# EAGLE design main3 (EAGLE 9.1.0)
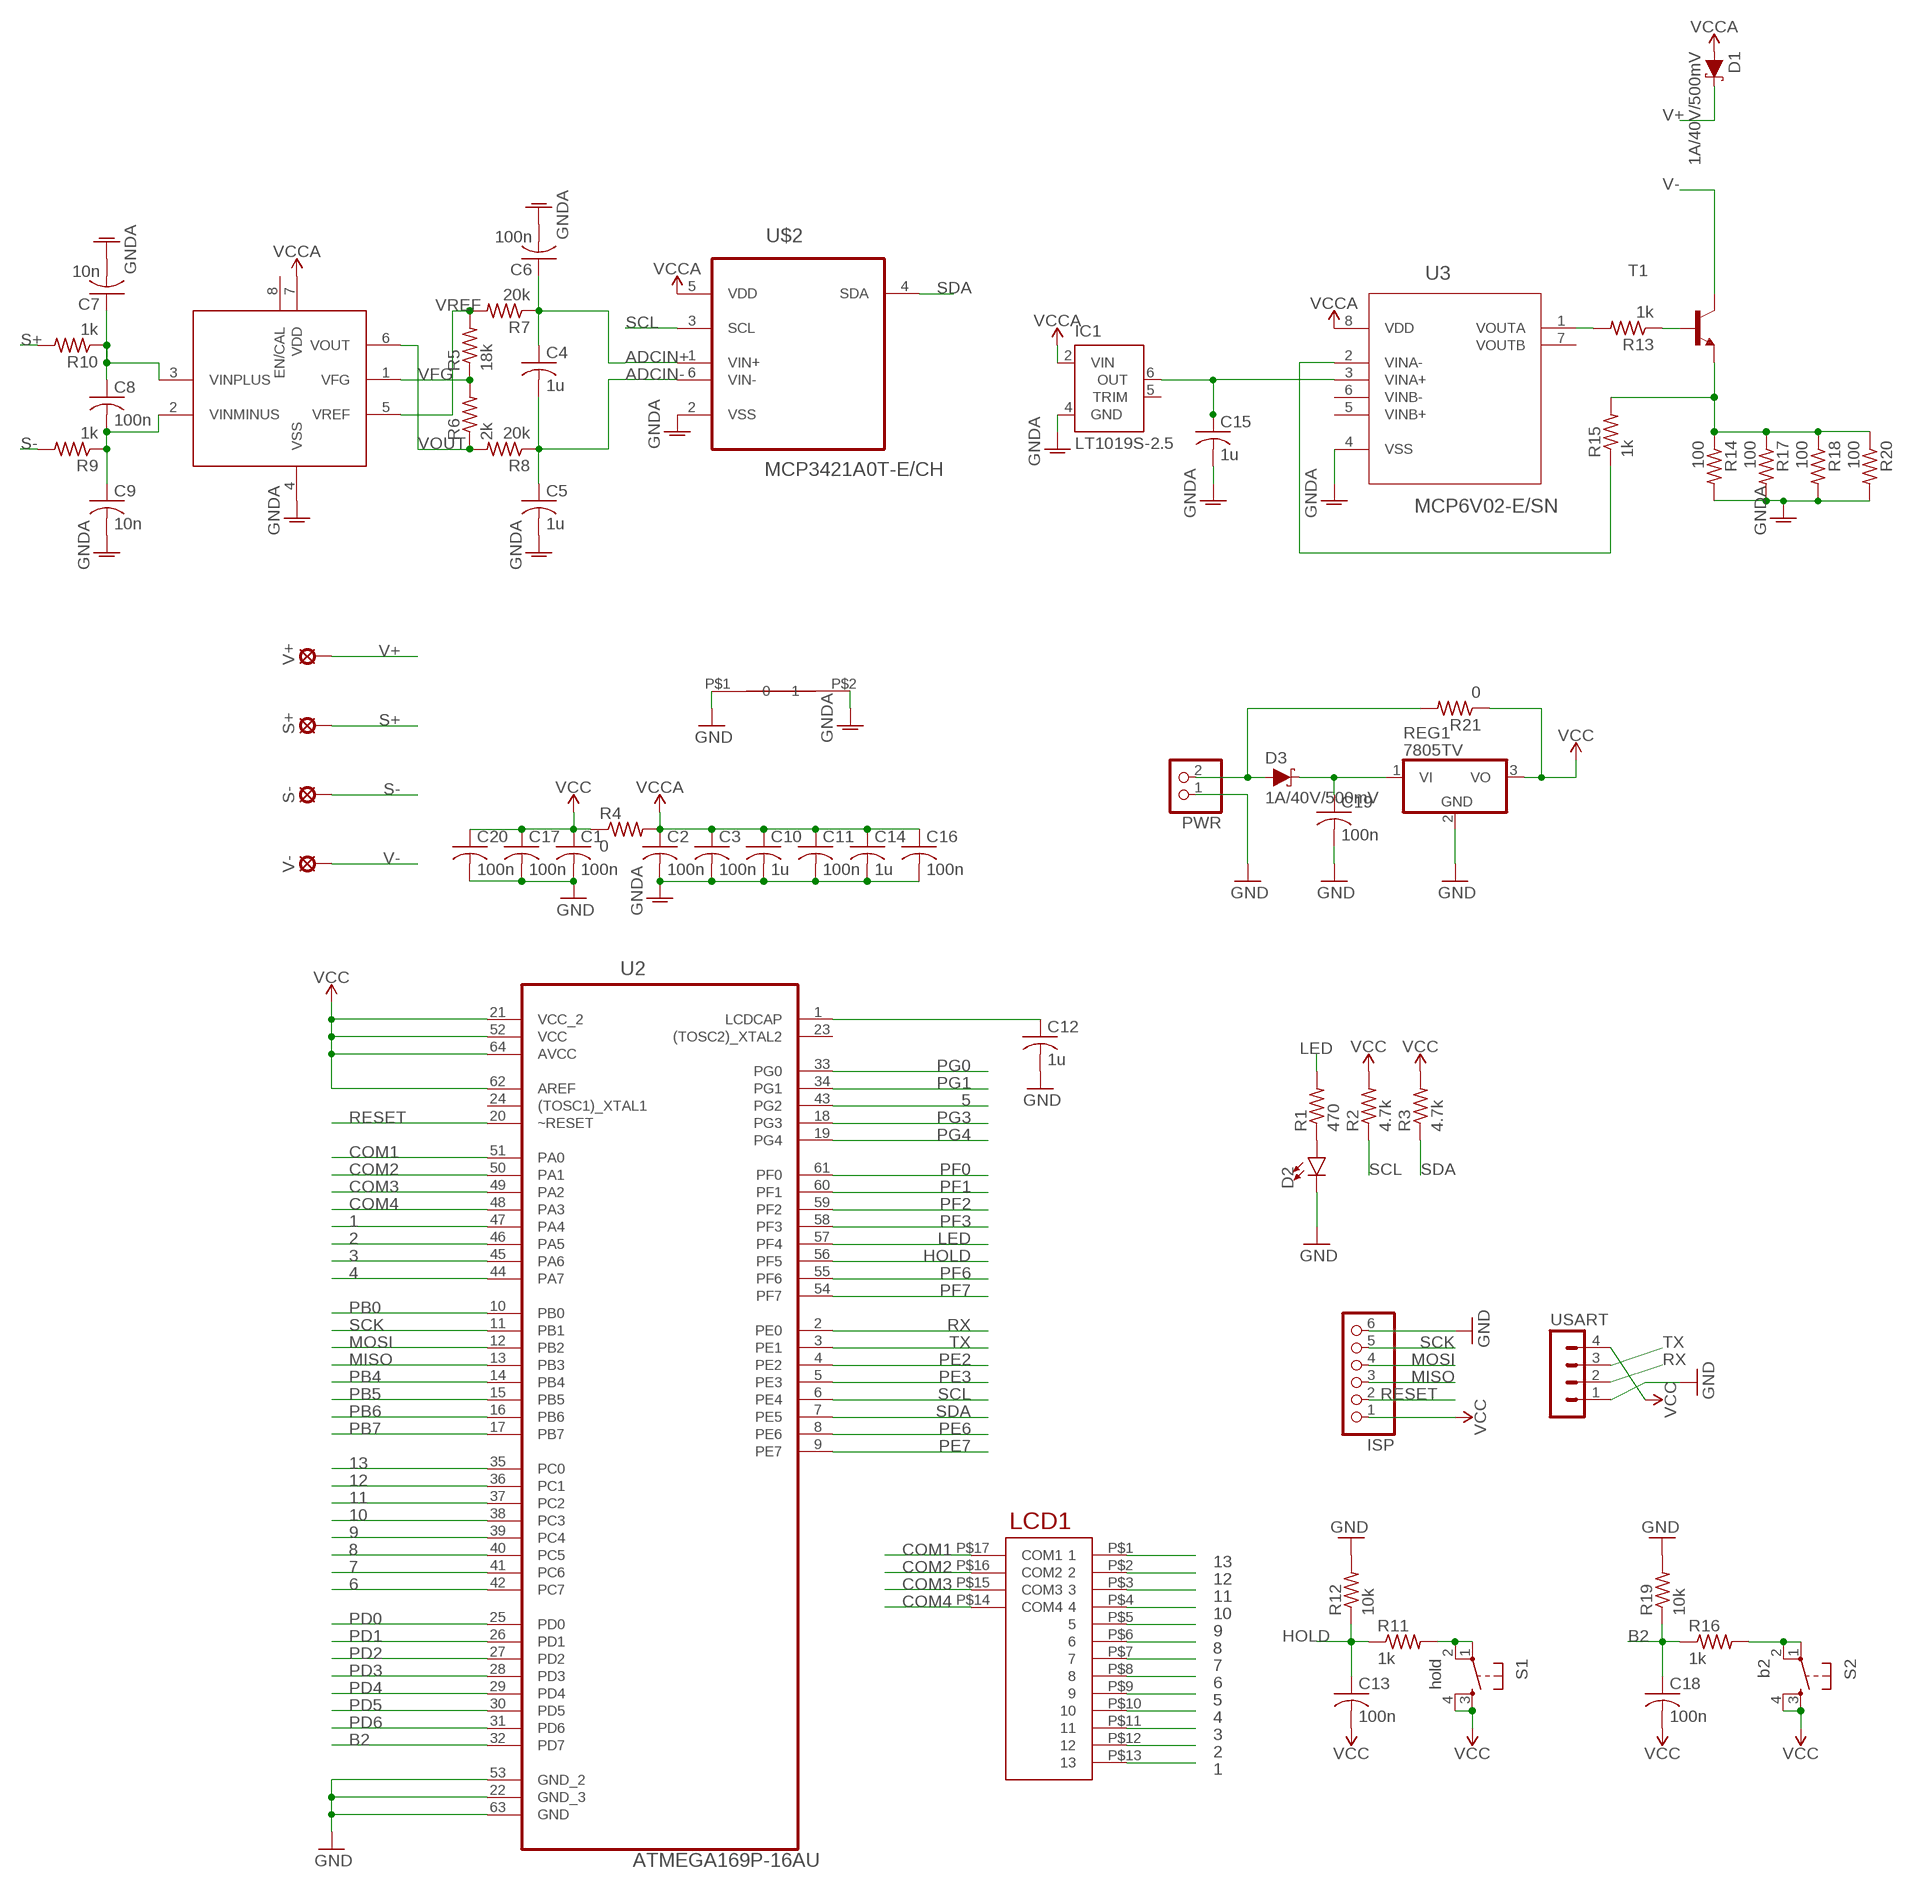
[diagram p0: schematic, sheet 1]

## Parts
C1  100n  C-USC0603  [C0603]
C2  100n  C-USC0603  [C0603]
C3  100n  C-USC0603  [C0603]
C4  1u  C-USC0603  [C0603]
C5  1u  C-USC0603  [C0603]
C6  100n  C-USC0603  [C0603]
C7  10n  C-USC0603  [C0603]
C8  100n  C-USC0603  [C0603]
C9  10n  C-USC0603  [C0603]
C10  1u  C-USC0603  [C0603]
C11  100n  C-USC0603  [C0603]
C12  1u  C-USC0603  [C0603]
C13  100n  C-USC0603  [C0603]
C14  1u  C-USC0603  [C0603]
C15  1u  C-USC0603  [C0603]
C16  100n  C-USC0603  [C0603]
C17  100n  C-USC0603  [C0603]
C18  100n  C-USC0603  [C0603]
C19  100n  C-USC0603  [C0603]
C20  100n  C-USC0603  [C0603]
D1  1A/40V/500mV  DIODE-SCHOTTKY-SS14  [SMA-DIODE]
D2  LED5MM  [LED_5MM]
D3  1A/40V/500mV  DIODE-SCHOTTKY-SS14  [SMA-DIODE]
IC1  LT1019S-2.5  [SOIC8]
ISP  PINHD-1X6  [1X06]
LCD1  GDC0570_LCD  [GDC0570_LCD]
PWR  PINHD-1X2  [1X02]
R1  470  R-US_R0603  [R0603]
R2  4.7k  R-US_R0603  [R0603]
R3  4.7k  R-US_R0603  [R0603]
R4  0  R-US_0309/12  [0309/12]
R5  18k  R-US_R0603  [R0603]
R6  2k  R-US_R0603  [R0603]
R7  20k  R-US_R0603  [R0603]
R8  20k  R-US_R0603  [R0603]
R9  1k  R-US_R0603  [R0603]
R10  1k  R-US_R0603  [R0603]
R11  1k  R-US_R0603  [R0603]
R12  10k  R-US_R0603  [R0603]
R13  1k  R-US_R0603  [R0603]
R14  100  R-US_R0603  [R0603]
R15  1k  R-US_R0603  [R0603]
R16  1k  R-US_R0603  [R0603]
R17  100  R-US_R0603  [R0603]
R18  100  R-US_R0603  [R0603]
R19  10k  R-US_R0603  [R0603]
R20  100  R-US_R0603  [R0603]
R21  0  R-US_R0603  [R0603]
REG1  7805TV  [TO220V]
S1  hold  TAC_SWITCHPTH  [TACTILE-PTH]
S2  b2  TAC_SWITCHPTH  [TACTILE-PTH]
S+  MCS08  [MCS08]
S-  MCS08  [MCS08]
T1  MMBT3904LT1-NPN-SOT23-BEC  [SOT23-BEC]
U2  ATMEGA169P-16AU  [QFP80P1600X1600X120-64N]
U3  MCP6V02-E/SN  [SOIC127P600X175-8N]
U$2  MCP3421A0T-E/CH  [SOT95P270X145-6N]
U$3  MCP6N11  [SOIC8]
U$10  SHORT32  [SHORT_32]
USART  MA04-1  [MA04-1]
V+  MCS08  [MCS08]
V-  MCS08  [MCS08]

## Nets
1: LCD1.P$13 U2.47(PA4)
2: LCD1.P$12 U2.46(PA5)
3: LCD1.P$11 U2.45(PA6)
4: LCD1.P$10 U2.44(PA7)
5: LCD1.P$9 U2.43(PG2)
6: LCD1.P$8 U2.42(PC7)
7: LCD1.P$7 U2.41(PC6)
8: LCD1.P$6 U2.40(PC5)
9: LCD1.P$5 U2.39(PC4)
10: LCD1.P$4 U2.38(PC3)
11: LCD1.P$3 U2.37(PC2)
12: LCD1.P$2 U2.36(PC1)
13: LCD1.P$1 U2.35(PC0)
ADCIN+: C4.1 C6.1 R7.1 U$2.1(VIN+)
ADCIN-: C4.2 C5.1 R8.1 U$2.6(VIN-)
B2: C18.1 R16.1 R19.1 U2.32(PD7)
COM1: LCD1.P$17(COM1) U2.51(PA0)
COM2: LCD1.P$16(COM2) U2.50(PA1)
COM3: LCD1.P$15(COM3) U2.49(PA2)
COM4: LCD1.P$14(COM4) U2.48(PA3)
GND: C1.2 C12.2 C17.2 C19.2 C20.2 D2.K(C) ISP.6 PWR.1 R12.2 R19.2 REG1.2(GND) U2.22(GND_3) U2.53(GND_2) U2.63(GND) U$10.P$1 USART.1
GNDA: C2.2 C3.2 C5.2 C6.2 C7.2 C9.2 C10.2 C11.2 C14.2 C15.2 C16.2 IC1.4(GND) R14.2 R17.2 R18.2 R20.2 U3.4(VSS) U$2.2(VSS) U$3.4(VSS) U$10.P$2
HOLD: C13.1 R11.1 R12.1 U2.56(PF5)
LCDCAP: C12.1 U2.1(LCDCAP)
LED: R1.2 U2.57(PF4)
MISO: ISP.3 U2.13(PB3)
MOSI: ISP.4 U2.12(PB2)
N2: R16.2 S2.1 S2.2
N$1: D3.A PWR.2 R21.2
N$2: C15.1 IC1.6(OUT) U3.3(VINA+)
N$3: R14.1 R15.2 R17.1 R18.1 R20.1 T1.E
N$4: C8.2 C9.1 R9.1 U$3.2(VINMINUS)
N$5: C7.1 C8.1 R10.1 U$3.3(VINPLUS)
N$6: D2.A R1.1
N$7: R13.2 U3.1(VOUTA)
N$8: R13.1 T1.B
N$9: R15.1 U3.2(VINA-)
N$10: R11.2 S1.1 S1.2
N$11: C19.1 D3.C REG1.1(VI)
PB0: U2.10(PB0)
PB4: U2.14(PB4)
PB5: U2.15(PB5)
PB6: U2.16(PB6)
PB7: U2.17(PB7)
PD0: U2.25(PD0)
PD1: U2.26(PD1)
PD2: U2.27(PD2)
PD3: U2.28(PD3)
PD4: U2.29(PD4)
PD5: U2.30(PD5)
PD6: U2.31(PD6)
PE2: U2.4(PE2)
PE3: U2.5(PE3)
PE6: U2.8(PE6)
PE7: U2.9(PE7)
PF0: U2.61(PF0)
PF1: U2.60(PF1)
PF2: U2.59(PF2)
PF3: U2.58(PF3)
PF6: U2.55(PF6)
PF7: U2.54(PF7)
PG0: U2.33(PG0)
PG1: U2.34(PG1)
PG3: U2.18(PG3)
PG4: U2.19(PG4)
RESET: ISP.2 U2.20(~RESET)
RX: U2.2(PE0) USART.2
S+: R10.2 S+.MP
S-: R9.2 S-.MP
SCK: ISP.5 U2.11(PB1)
SCL: R2.1 U2.6(PE4) U$2.3(SCL)
SDA: R3.1 U2.7(PE5) U$2.4(SDA)
TX: U2.3(PE1) USART.3
V+: D1.C V+.MP
V-: T1.C V-.MP
VCC: C1.1 C13.2 C17.1 C18.2 C20.1 ISP.1 R2.2 R3.2 R4.1 R21.1 REG1.3(VO) S1.3 S1.4 S2.3 S2.4 U2.21(VCC_2) U2.52(VCC) U2.62(AREF) U2.64(AVCC) USART.4
VCCA: C2.1 C3.1 C10.1 C11.1 C14.1 C16.1 D1.A IC1.2(VIN) R4.2 U3.8(VDD) U$2.5(VDD) U$3.7(VDD)
VFG: R5.1 R6.2 U$3.1(VFG)
VOUT: R6.1 R8.2 U$3.6(VOUT)
VREF: R5.2 R7.2 U$3.5(VREF)
Unconnected: IC1.5(TRIM) U2.23((TOSC2)_XTAL2) U2.24((TOSC1)_XTAL1) U3.5(VINB+) U3.6(VINB-) U3.7(VOUTB) U$3.8(EN/CAL)

## Library data of the parts
C1-C20 = rcl:C-US: CAPACITOR, American symbol; SPICEPREFIX: C
D1 D3 = SparkFun-DiscreteSemi:DIODE-SCHOTTKY: Schottky diode A Schottky diode is a semiconductor diode which has a low forward voltage drop and a very fast switching action.; PROD_ID: DIO-08053
D2 = SparkFun-LED:LED: LED (Generic) Standard schematic elements and footprints for 5mm, 3mm, 1206, and 0603 sized LEDs. Generic LEDs with no color specified.
IC1 = linear-technology:LT1019?*: Precision Voltage Reference Source: http://www.linear.com/pc/downloadDocument.do?navId=H0,C1,C1154,C1002,C1243,P1130,D3834; MPN: LT1019CS8-2.5#PBF; OC_FARNELL: 9559426; OC_NEWARK: 57M0929
ISP = pinhead:PINHD-1X6: PIN HEADER
LCD1 = 7_segment_lib:GDC0570_LCD
PWR = pinhead:PINHD-1X2: PIN HEADER
R1-R21 = rcl:R-US_: RESISTOR, American symbol; SPICEPREFIX: R
REG1 = linear:78*: Positive VOLTAGE REGULATOR Source: http://cache.national.com/ds/LM/LM78L05.pdf http://www.fairchildsemi.com/ds/LM/LM7805.pdf
S1 S2 = SparkFun-Retired:TAC_SWITCH: Momentary Switch Button commonly used for reset or general input. Spark Fun Electronics SKU : COM-00097 SMT- SWCH-08247
S+ S- V+ V- = solpad:MCS08: SOLDER PAD MC S0,8, drill 1.2 mm, distributor Buerklin, 08F130
T1 = DC_LOAD_AU:*-NPN-: NPN Transistror BF959 corrected 2008.03.06
U2 = 7_segment_lib:ATMEGA169P-16AU: 8-bit Microcontroller with 16K Bytes In-System Programmable Flash; MPN: ATMEGA169P-16AU; OC_FARNELL: 1675975; OC_NEWARK: 33P6478; PACKAGE: TQFP-64; SUPPLIER: Atmel
U3 = Microchip_By_element14_Batch_1:MCP6V02-E/SN: Auto-Zeroed Op Amps; MPN: MCP6V02-E/SN; OC_FARNELL: 1629346; OC_NEWARK: 27M0220; PACKAGE: SOIC-8; SUPPLIER: Microchip
U$2 = Microchip_By_element14_Batch_1:MCP3421A0T-E/CH: Analog-to-Digital Converter; MPN: MCP3421A0T-E/CH; OC_FARNELL: 1605567; OC_NEWARK: 77M2561; PACKAGE: SOT-6; SUPPLIER: Microchip
U$3 = 7_segment_lib:MCP6N11
U$10 = 7_segment_lib:SHORT
USART = con-lstb:MA04-1: PIN HEADER; OC_FARNELL: unknown; OC_NEWARK: unknown

## Board
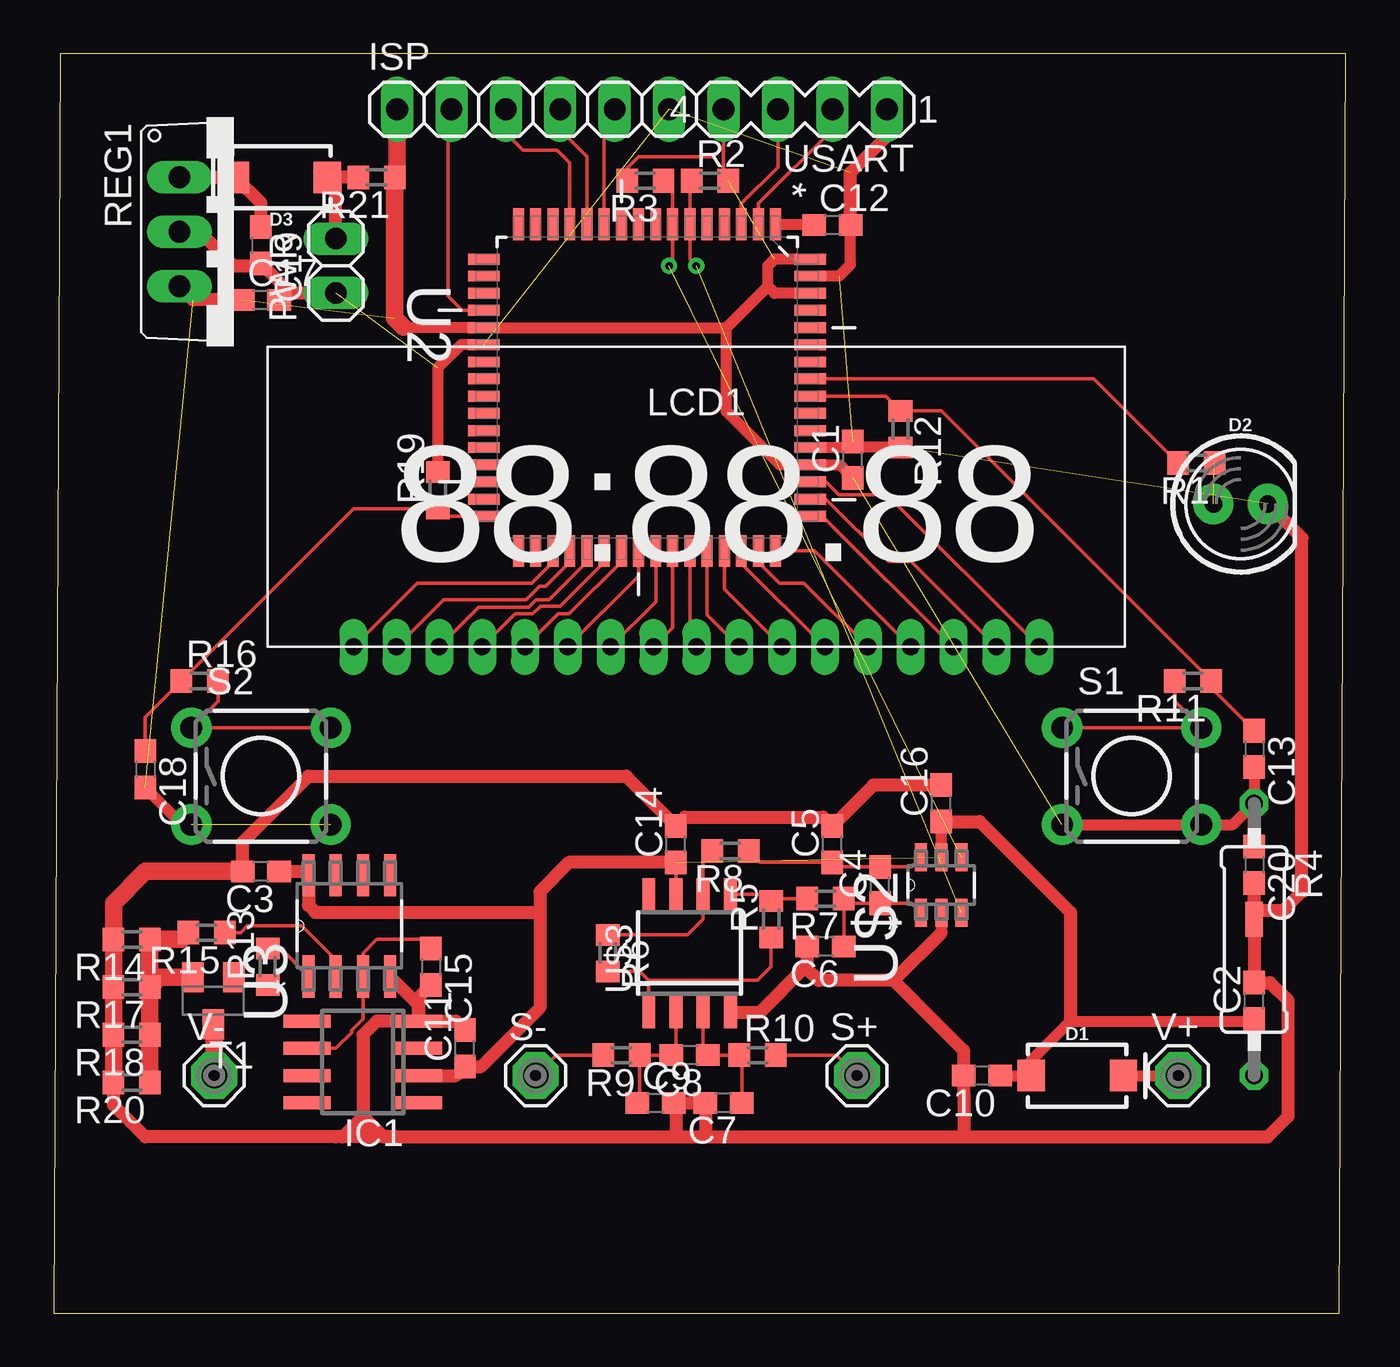
[diagram p1: board, top side]
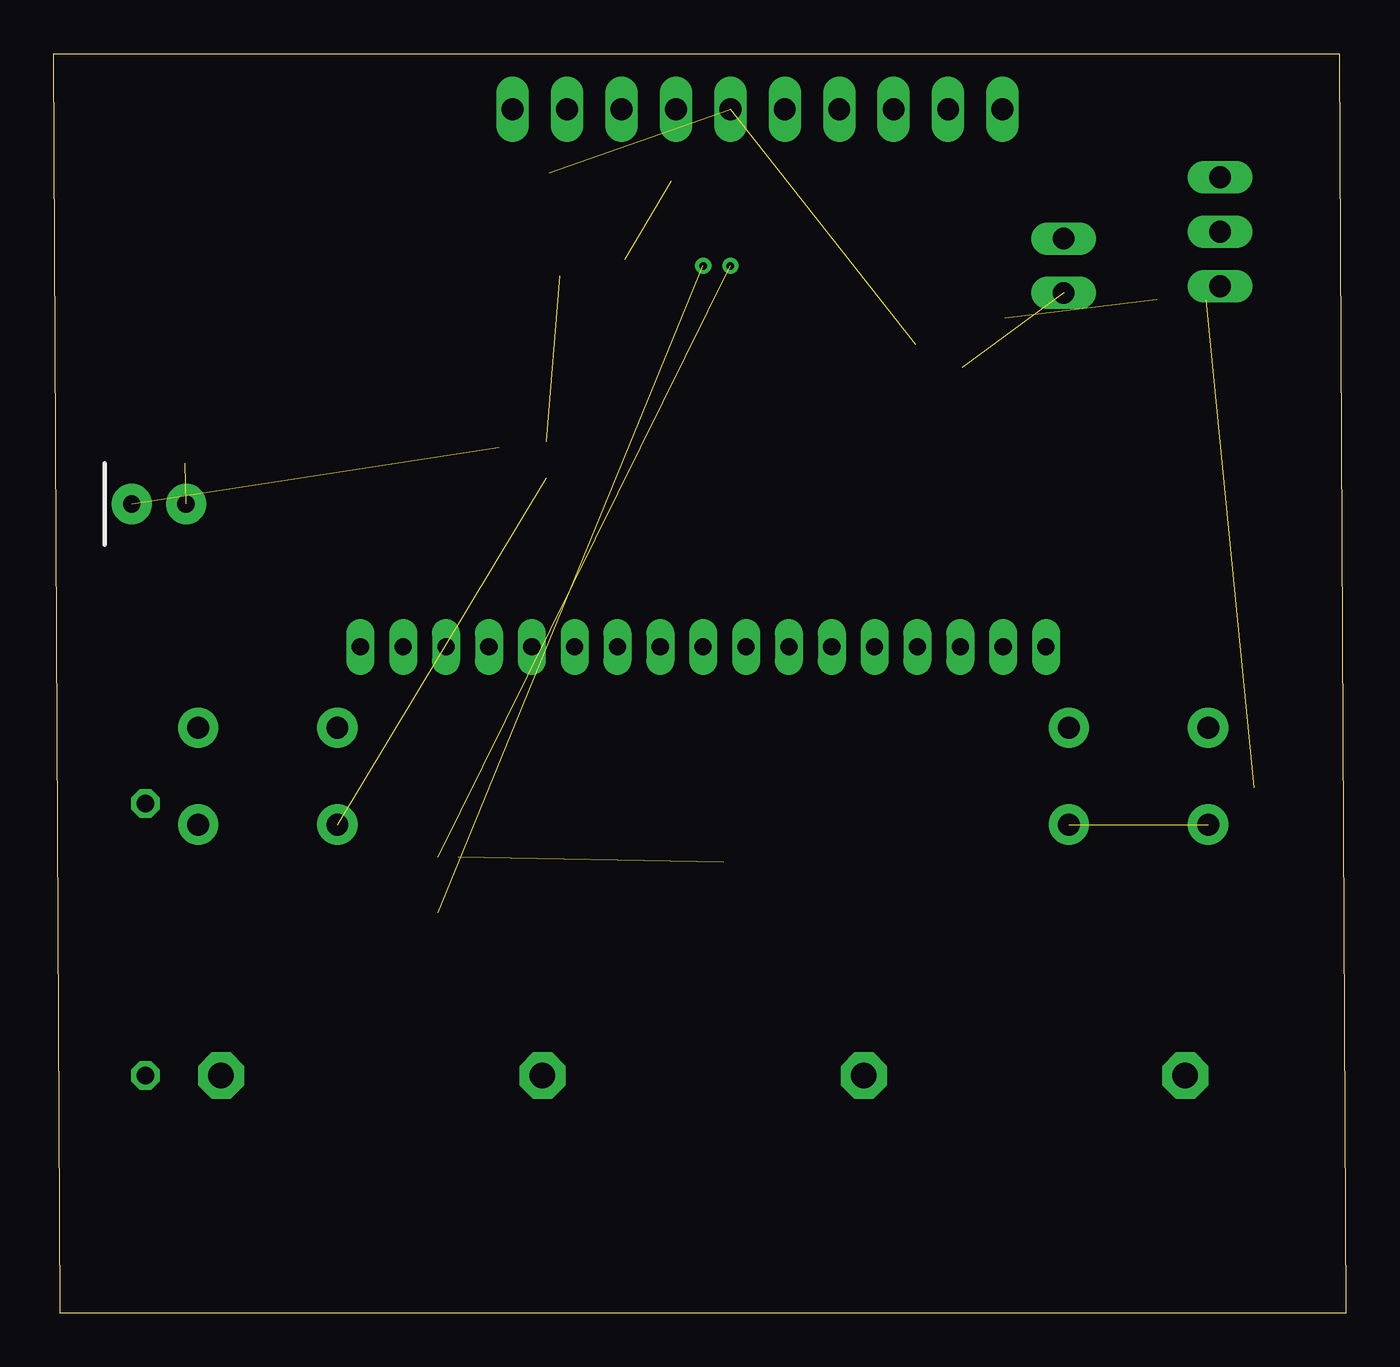
[diagram p2: board, bottom side, seen from below]

Size 60.32 x 58.76 mm. Coordinates in mm from the lower left corner, seen from the top.
Outline: 0,0 60,0 60.32,58.76 0.32,58.76 0,0
Copper layers (1*16): Top 0.035mm / dielectric 1.5mm / Bottom 0.035mm
Design rules "default": minimum track width 6mil, minimum drill 0.35mm, track to track 6mil, track to pad 6mil, pad to pad 6mil, via to via 6mil, smd to smd 6mil, copper to edge 40mil, drill to drill 6mil, minimum pad ring 10mil, minimum via ring 8mil, stop-mask expansion 4mil, vias tented up to drill 0mil, thermal gap 10mil

### Footprints (pad centres in the part's own frame; a part is rotated, then mirrored left to right if it is on the bottom)
C0603 = smd 1.1 x 1: 1 -0.85,0; 2 0.85,0
SMA-DIODE = smd 1.27 x 1.47: A -2.15,0; C 2.15,0
LED_5MM = drill 0.813 pad 1.88: A -1.27,0; K 1.27,0
SOIC8 = smd 0.6 x 2.2: 1 -1.905,-2.6; 2 -0.635,-2.6; 3 0.635,-2.6; 4 1.905,-2.6; 5 1.905,2.6; 6 0.635,2.6; 7 -0.635,2.6; 8 -1.905,2.6
1X06 = drill 1.016 long: 1 -6.35,0; 2 -3.81,0; 3 -1.27,0; 4 1.27,0; 5 3.81,0; 6 6.35,0
GDC0570_LCD = drill 0.8 long: P$1 -16,0; P$2 -14,0; P$3 -12,0; P$4 -10,0; P$5 -8,0; P$6 -6,0; P$7 -4,0; P$8 -2,0; P$9 0,0; P$10 2,0; P$11 4,0; P$12 6,0; P$13 8,0; P$14 10,0; P$15 12,0; P$16 14,0; P$17 16,0
1X02 = drill 1.016 long: 1 -1.27,0; 2 1.27,0
R0603 = smd 1 x 1.1: 1 -0.85,0; 2 0.85,0
0309/12 = drill 0.813 octagon: 1 -6.35,0; 2 6.35,0
TO220V = drill 1.016 long: 1 -2.54,-2.54; 2 0,-2.54; 3 2.54,-2.54
TACTILE-PTH = drill 1.016 pad 1.88: 1 -3.251,2.261; 2 3.251,2.261; 3 -3.251,-2.261; 4 3.251,-2.261
MCS08 = drill 1.194 pad 2.159 octagon: MP 0,0
SOT23-BEC = smd 1 x 1.4: B -0.95,-1.1; C 0,1.1; E 0.95,-1.1
QFP80P1600X1600X120-64N = smd 1.473 x 0.508: 1 -7.62,5.994; 2 -7.62,5.207; 3 -7.62,4.394; 4 -7.62,3.607; 5 -7.62,2.794; 6 -7.62,2.007; 7 -7.62,1.194; 8 -7.62,0.406; 9 -7.62,-0.406; 10 -7.62,-1.194; 11 -7.62,-2.007; 12 -7.62,-2.794; 13 -7.62,-3.607; 14 -7.62,-4.394; 15 -7.62,-5.207; 16 -7.62,-5.994; 33 7.62,-5.994; 34 7.62,-5.207; 35 7.62,-4.394; 36 7.62,-3.607; 37 7.62,-2.794; 38 7.62,-2.007; 39 7.62,-1.194; 40 7.62,-0.406; 41 7.62,0.406; 42 7.62,1.194; 43 7.62,2.007; 44 7.62,2.794; 45 7.62,3.607; 46 7.62,4.394; 47 7.62,5.207; 48 7.62,5.994 | smd 0.508 x 1.473: 17 -5.994,-7.62; 18 -5.207,-7.62; 19 -4.394,-7.62; 20 -3.607,-7.62; 21 -2.794,-7.62; 22 -2.007,-7.62; 23 -1.194,-7.62; 24 -0.406,-7.62; 25 0.406,-7.62; 26 1.194,-7.62; 27 2.007,-7.62; 28 2.794,-7.62; 29 3.607,-7.62; 30 4.394,-7.62; 31 5.207,-7.62; 32 5.994,-7.62; 49 5.994,7.62; 50 5.207,7.62; 51 4.394,7.62; 52 3.607,7.62; 53 2.794,7.62; 54 2.007,7.62; 55 1.194,7.62; 56 0.406,7.62; 57 -0.406,7.62; 58 -1.194,7.62; 59 -2.007,7.62; 60 -2.794,7.62; 61 -3.607,7.62; 62 -4.394,7.62; 63 -5.207,7.62; 64 -5.994,7.62
SOIC127P600X175-8N = smd 1.981 x 0.559: 1 -2.362,1.905; 2 -2.362,0.635; 3 -2.362,-0.635; 4 -2.362,-1.905; 5 2.362,-1.905; 6 2.362,-0.635; 7 2.362,0.635; 8 2.362,1.905
SOT95P270X145-6N = smd 1.321 x 0.559: 1 -1.295,0.94; 2 -1.295,0; 3 -1.295,-0.94; 4 1.295,-0.94; 5 1.295,0; 6 1.295,0.94
SOIC8' = smd 0.6 x 1.5: 1 -1.905,-2.75; 2 -0.635,-2.75; 3 0.635,-2.75; 4 1.905,-2.75; 5 1.905,2.75; 6 0.635,2.75; 7 -0.635,2.75; 8 -1.905,2.75
SHORT_32 = smd 0.813 x 0.813: P$1 -0.406,0; P$2 0.406,0
MA04-1 = drill 1.016 long: 1 -3.81,0; 2 -1.27,0; 3 1.27,0; 4 3.81,0

### Placement (x,y rotation side)
C1  37.3,39.81 90 top
C2  56.03,14.57 90 top
C3  9.68,20.61 180 top
C4  38.57,19.97 90 top
C5  36.35,21.88 90 top
C6  36.03,17.11 180 top
C7  31.27,9.81 180 top
C8  29.68,12.03 180 top
C9  28.09,9.81 0 top
C10  43.34,11.08 180 top
C11  19.2,12.35 90 top
C12  36.35,50.77 0 top
C13  56.03,26.32 270 top
C14  29.05,21.88 90 top
C15  17.62,16.16 270 top
C16  41.43,23.78 90 top
C17  9.68,47.27 0 top
C18  4.28,25.37 270 top
C19  9.68,49.81 270 top
C20  56.03,20.92 270 top
D1  47.78,11.08 0 top
D2  55.4,37.75 0 top
D3  10.63,52.99 180 top
IC1  14.44,11.71 90 top
ISP  22.38,56.16 0 top
LCD1  30,31.08 0 top
PWR  13.17,48.86 90 top
R1  53.34,39.66 180 top
R2  30.64,52.83 0 top
R3  27.62,52.83 180 top
R4  56.03,17.43 270 top
R5  33.49,18.38 90 top
R6  25.87,16.8 270 top
R7  36.03,19.34 180 top
R8  31.59,21.56 180 top
R9  26.51,12.03 180 top
R10  32.86,12.03 0 top
R11  53.18,29.5 180 top
R12  39.52,41.24 270 top
R13  10,16.16 90 top
R14  3.65,17.43 180 top
R15  7.14,17.75 180 top
R16  6.82,29.5 0 top
R17  3.65,15.21 180 top
R18  3.65,12.99 180 top
R19  17.94,38.39 90 top
R20  3.65,10.76 180 top
R21  15.08,52.99 180 top
REG1  8.41,50.45 270 top
S1  50.32,25.05 0 top
S2  9.68,25.05 0 top
S+  37.5,11.08 0 top
S-  22.5,11.08 0 top
T1  7.46,14.57 180 top
U2  27.7,43.18 270 top
U3  13.81,18.07 90 top
U$2  41.43,19.97 90 top
U$3  MCP6N11  [SOIC8']  29.68,16.8 0 top
U$10  56.03,18.38 270 top
USART  35.08,56.16 180 top
V+  52.5,11.08 0 top
V-  7.5,11.08 0 top

### Tracks (layer width: path | path; a pad name or v marks a point on that pad's centre or on a via)
1
  Top 0.152: LCD1.P$13 35.03,34.05 33.89,34.05 32.91,35.03 U2.47
2
  Top 0.152: LCD1.P$12 32.09,34.99 U2.46
3
  Top 0.152: U2.45 31.31,33.77 LCD1.P$11
4
  Top 0.152: U2.44 30.49,32.59 LCD1.P$10
5
  Top 0.152: U2.43 29.71,31.37 LCD1.P$9
6
  Top 0.152: U2.42 28.89,31.97 LCD1.P$8
7
  Top 0.152: U2.41 28.11,33.19 LCD1.P$7
8
  Top 0.152: U2.40 27.29,34.37 LCD1.P$6
9
  Top 0.152: U2.39 26.51,35.06 24.06,32.62 23.54,32.62 LCD1.P$5
10
  Top 0.152: U2.38 25.69,35.03 23.63,32.97 22.72,32.97 22.37,32.62 21.54,32.62 LCD1.P$4
11
  Top 0.152: U2.37 24.91,35.06 23.13,33.28 22.53,33.28 22.17,32.92 19.84,32.92 LCD1.P$3
12
  Top 0.152: U2.36 24.09,35.03 22.96,33.9 22.68,33.9 22.06,33.28 18.2,33.28 LCD1.P$2
13
  Top 0.152: U2.35 23.31,35.06 22.3,34.05 16.97,34.05 LCD1.P$1
ADCIN+
  Top 0.152: C6.1 R7.1 37.1,19.12 C4.1 40.05,19.12 U$2.1
ADCIN-
  Top 0.152: U$2.6 40.05,20.82 C4.2 36.55,20.82 C5.1 32.97,21.02 R8.1
B2
  Top 0.152: C18.1 4.28,27.8 R16.1 14.01,37.53 R19.1 18.28,37.19 U2.32
COM1
  Top 0.152: LCD1.P$17 38.9,38.18 36.66,38.18 36.06,38.79 U2.51
COM2
  Top 0.152: LCD1.P$16 40.01,35.07 38.96,35.07 36.06,37.97 U2.50
COM3
  Top 0.152: LCD1.P$15 35.89,37.19 U2.49
COM4
  Top 0.152: LCD1.P$14 35.52,35.56 U2.48
GND  (5 unrouted)
  Top 0.508: U2.63 36.67,48.39 37.2,48.92 C12.2 | U2.53 37.02,40.39 C1.2 37.57,40.39 R12.2 | U2.22 19.02,45.19 17.94,44.1 R19.2
  Top 0.61: C12.2 37.2,53.2 38.89,54.9 USART.1 | REG1.2 6.82,50.45 8.41,48.86 9.58,48.86 C19.2 11.05,47.59 | 11.05,47.59 PWR.1 | C17.2 10.73,47.27 11.05,47.59 | C20.2 U$10.P$1 57.39,18.79 58.26,19.65 58.26,36.16 D2.K
GNDA
  Top 0.508: U$2.2 41.43,17.75
  Top 0.61: IC1.4 18.79,13.62 C11.2 | IC1.4 17.04,13.94 | 17.04,13.94 17.04,14.74 C15.2 | U3.4 17.04,14.37 17.04,13.94 | U$3.4 32.97,14.04 35.08,16.16 | C6.2 35.18,16.26 35.08,16.16 | 41.43,17.75 39.21,15.53 | 35.08,16.16 35.72,15.53 39.21,15.53 | 39.21,15.53 42.48,12.25 C10.2 42.48,10.23 42.48,8.44 42.7,8.22 | 31.59,8.22 30.64,8.22 30.42,8.44 C7.2 C9.2 29.05,9.71 29.05,8.22 | 31.59,8.22 40.48,8.22 42.7,8.22 | IC1.4 15.08,13.62 14.44,12.99 14.44,9.18 | 16.03,8.22 15.39,8.22 14.44,9.18 | 16.03,8.22 29.05,8.22 | 29.05,8.22 31.59,8.22 | 16.03,8.22 14.44,8.22 | 14.44,8.22 13.17,8.22 | 13.17,8.22 4.28,8.22 2.8,9.71 R20.2 | 14.44,9.18 14.44,8.22 | 14.44,9.18 13.49,8.22 13.17,8.22 | C16.2 38.26,24.63 C5.2 35.93,23.15 29.47,23.15 C14.2 26.72,25.05 11.9,25.05 8.83,21.98 C3.2 | 42.7,8.22 56.67,8.22 57.62,9.18 57.62,14.57 56.77,15.42 56.35,15.42 C2.2 U$10.P$2
  Top 0.813: R20.2 R18.2 R17.2 R14.2 2.8,19.12 4.28,20.61 C3.2
HOLD
  Top 0.152: C13.1 54.03,29.18 R11.1 41.43,42.09 R12.1 38.84,42.77 U2.56
LCDCAP
  Top 0.508: C12.1 33.73,50.77 U2.1
LED
  Top 0.152: U2.57 48.55,43.59 R1.2
MISO
  Top 0.152: U2.13 24.09,53.66 23.49,54.26 21.9,54.26 21.11,55.05 ISP.3
MOSI
  Top 0.152: U2.12 24.91,53.96 23.65,55.21 ISP.4
N2
  Top 0.152: R16.2 7.67,28.55 S2.1 S2.2
N$1
  Top 0.61: R21.2 13.17,52.99 | 13.17,52.99 D3.A | PWR.2 13.17,52.99
N$2
  Top 0.152: IC1.6 13.17,12.35 13.91,13.09 13.91,13.21 14.44,13.74 U3.3 14.44,16.8 15.08,17.43 17.2,17.43 C15.1
N$3
  Top 0.813: T1.E 4.96,15.67 R17.1 | R15.2 5.97,17.43 R14.1 R17.1 | R17.1 R18.1 R20.1
N$4
  Top 0.152: C9.1 27.36,9.92 R9.1 C8.2 29.05,12.25 U$3.2
N$5
  Top 0.152: U$3.3 30.32,12.25 C8.1 31.91,12.03 | 31.91,12.03 R10.1 | C7.1 32.12,11.82 31.91,12.03
N$6  (1 unrouted)
N$7
  Top 0.152: U3.1 10.59,17.01 R13.2
N$8
  Top 0.152: R13.1 8.77,15.31 T1.B
N$9
  Top 0.152: R15.1 8.73,17.75 9.05,18.07 11.59,18.07 13.17,16.48 U3.2
N$10
  Top 0.152: S1.1 S1.2 52.33,28.55 R11.2
N$11
  Top 0.61: REG1.1 D3.C 9.68,51.79 C19.1
RESET
  Top 0.152: U2.20 19.06,46.79 18.41,47.43 18.41,56.01 ISP.2
RX
  Top 0.152: U2.2 32.91,51.77 36.35,55.21 USART.2
S+
  Top 0.152: S+.MP 36.55,12.03 R10.2
S-
  Top 0.152: S-.MP 23.45,12.03 R9.2
SCK
  Top 0.152: U2.11 25.69,55.67 ISP.5
SCL  (via drill 0.35)  (1 unrouted)
  Top 0.152: R2.1 29.71,52.75 U2.6 29.71,49.16 v30,48.86
SDA  (via drill 0.35)  (1 unrouted)
  Top 0.152: R3.1 28.89,52.41 U2.7 28.89,49.03 v28.73,48.86
TX
  Top 0.152: U2.3 32.09,51.75 33.81,53.47 USART.3
V+
  Top 0.508: D1.C V+.MP
V-
  Top 0.813: V-.MP 7.5,13.43 T1.C
VCC  (5 unrouted)
  Top 0.152: R3.2 26.77,53.41 27.3,53.94 30.79,53.94 31.27,54.42 31.27,54.74 | 31.27,54.74 USART.4 | R2.2 31.27,53.05 31.27,54.74
  Top 0.508: U2.64 33.65,49.17 33.33,48.86 33.33,47.91 | U2.62 33.67,47.57 33.33,47.91 | 31.4,45.97 U2.21 17.3,45.97 | 31.4,45.97 33.33,47.91 | 31.4,45.97 31.4,42.07 33.89,39.57 U2.52 36.69,39.57 C1.1 | S2.3 6.01,22.79 C18.2 | C13.2 R4.1 55.04,22.79 S1.4 S1.3 | 17.3,45.97 17.01,45.97 16.98,46 | 16.35,46 17.27,46 17.3,45.97
  Top 0.61: C17.1 6.5,47.27 REG1.3 | C20.1 R4.1
  Top 0.813: ISP.1 16.03,53.09 R21.1 15.93,46.42 16.35,46
VCCA  (1 unrouted)
  Top 0.152: U$3.7 C14.1
  Top 0.508: R4.2 56.03,13.62 | 56.03,13.62 C2.1 | C10.1 D1.A 45.63,11.79 47.46,13.62 56.03,13.62 | U$2.5 C16.1
  Top 0.61: IC1.2 18.79,11.08 C11.1 19.94,11.5 22.7,14.26 22.7,18.7 | C3.1 11.73,20.61 U3.8 11.9,19.02 12.22,18.7 22.7,18.7 | C16.1 43.23,22.93 47.46,18.7 47.46,13.62 | 22.7,18.7 22.7,19.65 24.07,21.02 C14.1
VFG
  Top 0.152: U$3.1 27.78,15.53 | R6.2 27.36,15.95 27.78,15.53 | R5.1 33.49,16.16 32.86,15.53 27.78,15.53
VOUT
  Top 0.152: R6.1 29.58,17.64 30.32,18.38 U$3.6 30.32,21.14 R8.2
VREF
  Top 0.152: U$3.5 33.18,19.55 R5.2 33.59,19.34 R7.2